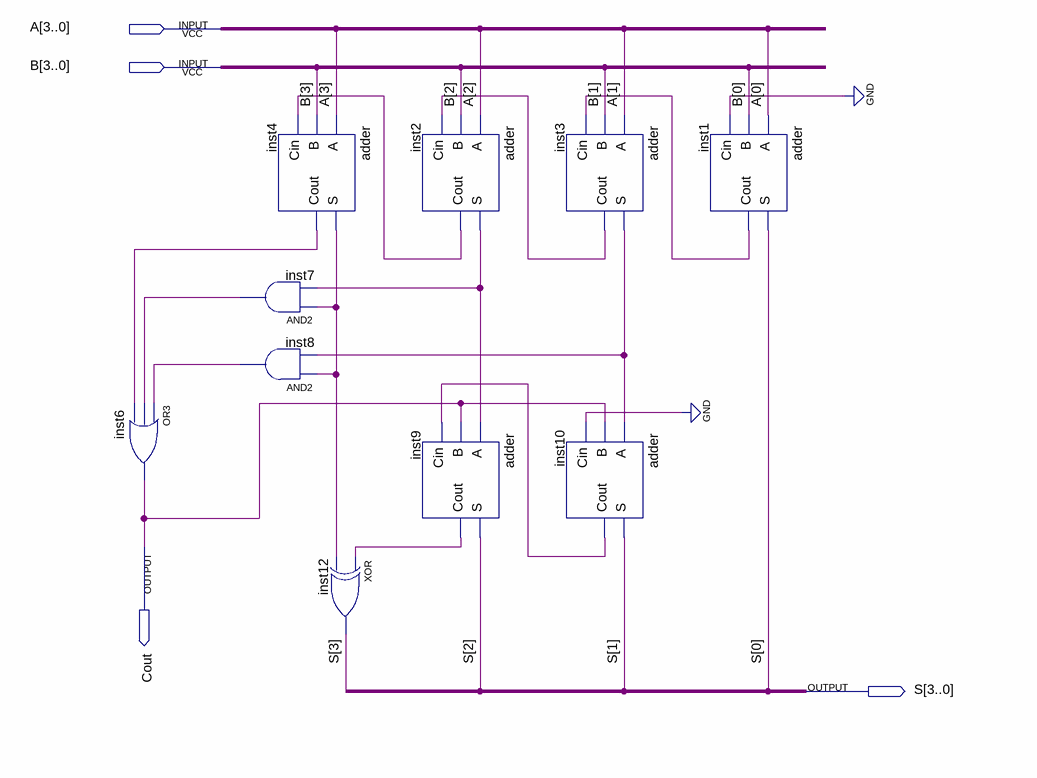
[diagram p0: schematic sheet]
// Quartus schematic somadorbcd.bdf as structural Verilog: 10 symbols, 4 pins
module somadorbcd (
  input  [3:0] A,
  input  [3:0] B,
  output Cout,
  output [3:0] S
);

  wire inst1_cout, inst2_cout, inst2_s, inst3_cout, inst3_s, inst4_cout, inst4_s, inst7_out, inst8_out,
       inst9_cout, inst10_cout;

  or inst6 (Cout, inst8_out, inst7_out, inst4_cout);
  and inst7 (inst7_out, inst4_s, inst2_s);
  and inst8 (inst8_out, inst4_s, inst3_s);
  adder inst4 (.A(A[3]), .B(B[3]), .Cin(inst2_cout), .S(inst4_s), .Cout(inst4_cout));
  xor inst12 (S[3], inst9_cout, inst4_s);
  adder inst2 (.A(A[2]), .B(B[2]), .Cin(inst3_cout), .S(inst2_s), .Cout(inst2_cout));
  adder inst9 (.A(inst2_s), .B(Cout), .Cin(inst10_cout), .S(S[2]), .Cout(inst9_cout));
  adder inst3 (.A(A[1]), .B(B[1]), .Cin(inst1_cout), .S(inst3_s), .Cout(inst3_cout));
  adder inst10 (.A(inst3_s), .B(Cout), .Cin(1'b0), .S(S[1]), .Cout(inst10_cout));
  adder inst1 (.A(A[0]), .B(B[0]), .Cin(1'b0), .S(S[0]), .Cout(inst1_cout));
endmodule
